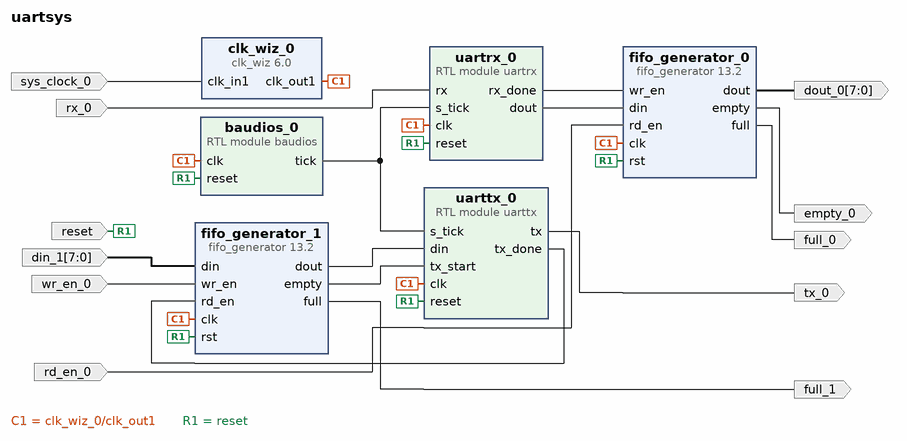
[diagram p0: block diagram of the top level]
# Vivado block design uartsys, xc7z020clg400-1, Vivado 2018.3
create_bd_design uartsys

create_bd_port -dir I rx_0
create_bd_port -dir I -type rst reset
set_property -dict {CONFIG.POLARITY ACTIVE_HIGH} [get_bd_ports reset]
create_bd_port -dir I -type clk sys_clock_0
set_property -dict {CONFIG.FREQ_HZ 125000000 CONFIG.PHASE 0.000} [get_bd_ports sys_clock_0]
create_bd_port -dir O full_0
create_bd_port -dir O empty_0
create_bd_port -dir O -from 7 -to 0 dout_0
create_bd_port -dir I rd_en_0
create_bd_port -dir O tx_0
create_bd_port -dir O full_1
create_bd_port -dir I -from 7 -to 0 din_1
create_bd_port -dir I wr_en_0

create_bd_cell -type module -reference uartrx uartrx_0
create_bd_cell -type ip -vlnv xilinx.com:ip:clk_wiz:6.0 clk_wiz_0
set_property -dict [list \
  CONFIG.CLKOUT1_JITTER 143.688 \
  CONFIG.CLKOUT1_REQUESTED_OUT_FREQ 50.000 \
  CONFIG.CLK_IN1_BOARD_INTERFACE sys_clock \
  CONFIG.MMCM_CLKOUT0_DIVIDE_F 20.000 \
  CONFIG.MMCM_DIVCLK_DIVIDE 1 \
  CONFIG.RESET_PORT resetn \
  CONFIG.RESET_TYPE ACTIVE_HIGH \
  CONFIG.USE_BOARD_FLOW true \
  CONFIG.USE_LOCKED false \
  CONFIG.USE_RESET false \
] [get_bd_cells clk_wiz_0]
create_bd_cell -type module -reference uarttx uarttx_0
create_bd_cell -type module -reference baudios baudios_0
create_bd_cell -type ip -vlnv xilinx.com:ip:fifo_generator:13.2 fifo_generator_0
set_property -dict [list \
  CONFIG.Fifo_Implementation Common_Clock_Builtin_FIFO \
  CONFIG.Input_Data_Width 8 \
  CONFIG.Input_Depth 512 \
] [get_bd_cells fifo_generator_0]
create_bd_cell -type ip -vlnv xilinx.com:ip:fifo_generator:13.2 fifo_generator_1
set_property -dict [list \
  CONFIG.Fifo_Implementation Common_Clock_Builtin_FIFO \
  CONFIG.Input_Data_Width 8 \
  CONFIG.Input_Depth 512 \
] [get_bd_cells fifo_generator_1]

# ---- connections ----

connect_bd_net -net clk_0_1 [get_bd_pins clk_wiz_0/clk_out1] \
  [get_bd_pins uartrx_0/clk] [get_bd_pins uarttx_0/clk] [get_bd_pins baudios_0/clk] [get_bd_pins fifo_generator_0/clk] \
  [get_bd_pins fifo_generator_1/clk]
connect_bd_net -net reset_0_1 [get_bd_ports reset] \
  [get_bd_pins uartrx_0/reset] [get_bd_pins uarttx_0/reset] [get_bd_pins baudios_0/reset] [get_bd_pins fifo_generator_0/rst] \
  [get_bd_pins fifo_generator_1/rst]
connect_bd_net -net rx_0_1 [get_bd_ports rx_0] [get_bd_pins uartrx_0/rx]
connect_bd_net [get_bd_pins baudios_0/tick] [get_bd_pins uartrx_0/s_tick] [get_bd_pins uarttx_0/s_tick]
connect_bd_net -net sys_clock_0_1 [get_bd_ports sys_clock_0] [get_bd_pins clk_wiz_0/clk_in1]
connect_bd_net [get_bd_pins uartrx_0/rx_done] [get_bd_pins fifo_generator_0/wr_en]
connect_bd_net [get_bd_pins uartrx_0/dout] [get_bd_pins fifo_generator_0/din]
connect_bd_net [get_bd_pins fifo_generator_0/full] [get_bd_ports full_0]
connect_bd_net [get_bd_pins fifo_generator_0/empty] [get_bd_ports empty_0]
connect_bd_net [get_bd_pins fifo_generator_0/dout] [get_bd_ports dout_0]
connect_bd_net -net rd_en_0_1 [get_bd_ports rd_en_0] [get_bd_pins fifo_generator_0/rd_en]
connect_bd_net [get_bd_pins fifo_generator_1/dout] [get_bd_pins uarttx_0/din]
connect_bd_net [get_bd_pins uarttx_0/tx_done] [get_bd_pins fifo_generator_1/rd_en]
connect_bd_net [get_bd_pins uarttx_0/tx] [get_bd_ports tx_0]
connect_bd_net [get_bd_pins fifo_generator_1/full] [get_bd_ports full_1]
connect_bd_net -net din_1_1 [get_bd_ports din_1] [get_bd_pins fifo_generator_1/din]
connect_bd_net -net wr_en_0_1 [get_bd_ports wr_en_0] [get_bd_pins fifo_generator_1/wr_en]
connect_bd_net [get_bd_pins fifo_generator_1/empty] [get_bd_pins uarttx_0/tx_start]

validate_bd_design
save_bd_design
